# Altium schematic sheet 04 - Camera Interface.SchDoc: Camera Interface (DPHYs)
size A3; Page Number: 4; Page Size: B; Page Count: 12; Board Rev: B; Project Name: CrossLink-NX Evaluation Board; RevCode: 1.0; Doc: 305-PD-19-0819; DsnPath: C:\Users\HAltinkilit\Downloads\Crosslink-NX-Design-Files\CrossLink-NX-Eval-Brd-Schematic-RevB-191122.DSN; SchematicName: SCHEMATIC1; PageName: 04 - Camera Interface; PageSize: B; TopSchematic: True
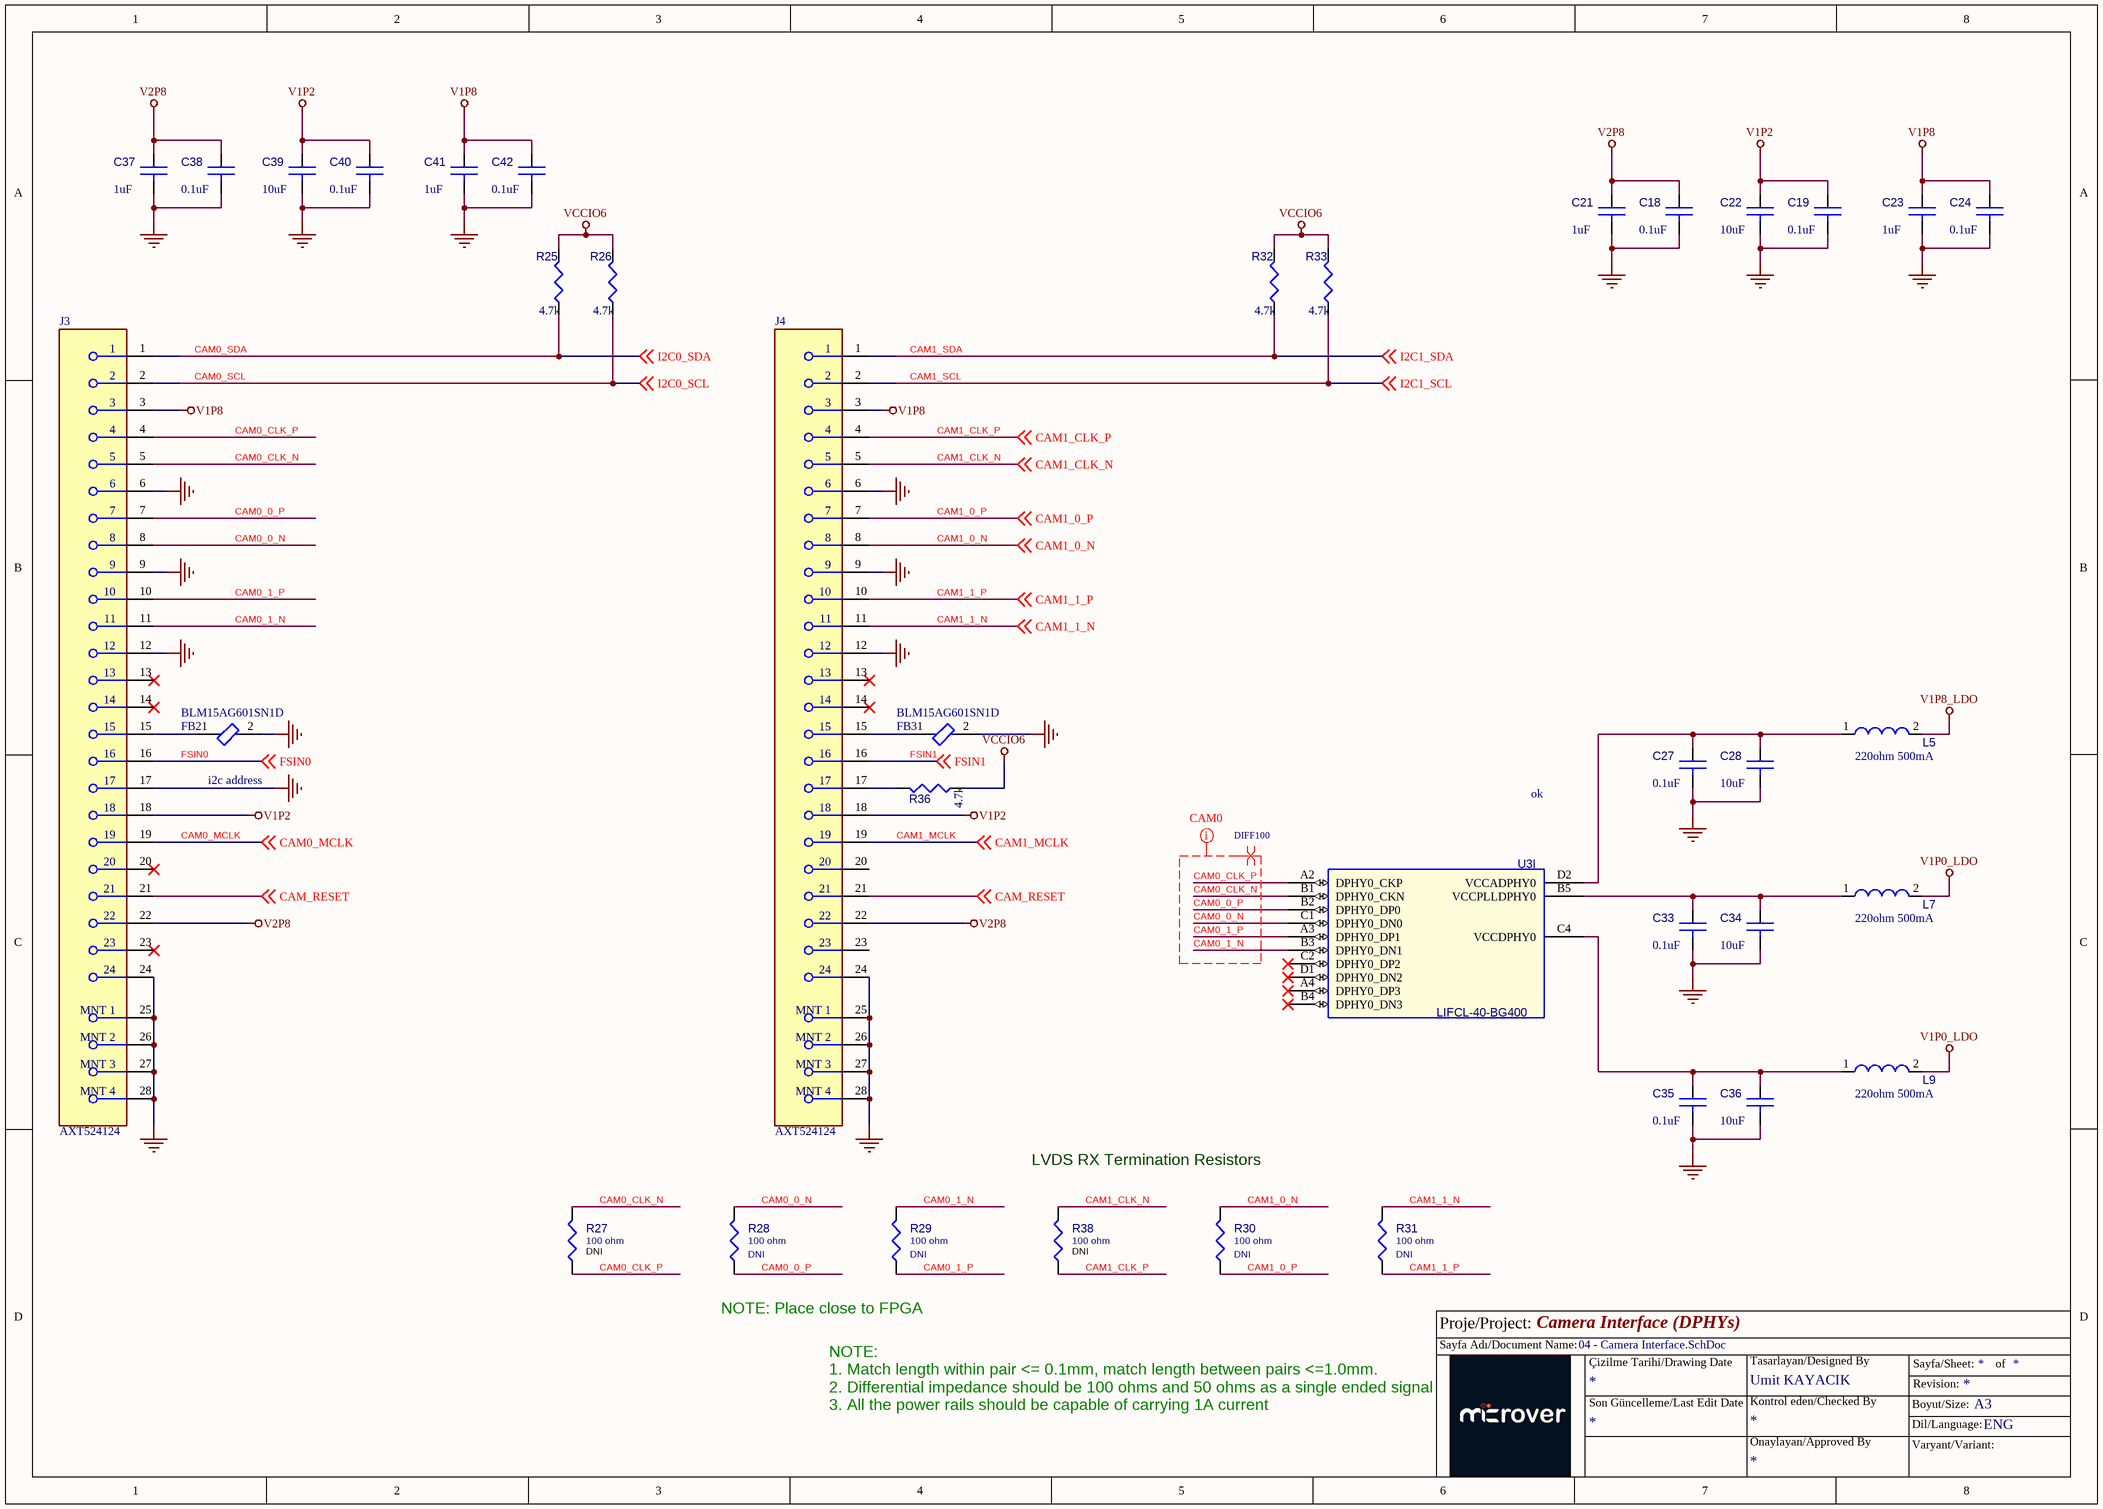
[diagram p0: 04 - Camera Interface.SchDoc]

## Parts
C18  0.1uF  [C0201]
C19  0.1uF  [C0201]
C21  1uF  [C0603]
C22  10uF  [C0603]
C23  1uF  [C0603]
C24  0.1uF  [C0201]
C27  0.1uF  [C0201]
C28  10uF  [C0402]
C33  0.1uF  [C0201]
C34  10uF  [C0402]
C35  0.1uF  [C0201]
C36  10uF  [C0402]
C37  1uF  [C0603]
C38  0.1uF  [C0201]
C39  10uF  [C0603]
C40  0.1uF  [C0201]
C41  1uF  [C0603]
C42  0.1uF  [C0201]
FB2  BLM15AG601SN1D  [FP-BLM15-0_05-MFG]
FB3  BLM15AG601SN1D  [FP-BLM15-0_05-MFG]
J3  AXT524124  [FP-AXT524124-MFG]
J4  AXT524124  [FP-AXT524124-MFG]
L5  220ohm 500mA  [FB0402]
L7  220ohm 500mA  [FB0402]
L9  220ohm 500mA  [FB0402]
R25  4.7k  [R0402]
R26  4.7k  [R0402]
R27  100 ohm  [R0201]
R28  100 ohm  Assy: DNI  [R0201]
R29  100 ohm  Assy: DNI  [R0201]
R30  100 ohm  Assy: DNI  [R0201]
R31  100 ohm  Assy: DNI  [R0201]
R32  4.7k  [R0402]
R33  4.7k  [R0402]
R36  4.7k  [R0402]
R38  100 ohm  [R0201]
U3  LIFCL-40-BG400  [LIFCL-40-BG400]  (part I of 15)

## Nets
GND: C18.2 C19.2 C21.2 C22.2 C23.2 C24.2 C27.2 C28.2 C33.2 C34.2 C35.2 C36.2 C37.2 C38.2 C39.2 C40.2 C41.2 C42.2 FB2.2 FB3.2 J3.6 J3.9 J3.12 J3.17 J3.24 J3.25(MNT_1) J3.26(MNT_2) J3.27(MNT_3) J3.28(MNT_4) J4.6 J4.9 J4.12 J4.24 J4.25(MNT_1) J4.26(MNT_2) J4.27(MNT_3) J4.28(MNT_4)
V1P0_LDO: L7.2 L9.2
V1P2: C19.1 C22.1 C39.1 C40.1 J3.18 J4.18
V1P8: C23.1 C24.1 C41.1 C42.1 J3.3 J4.3
V1P8_LDO: L5.2
V2P8: C18.1 C21.1 C37.1 C38.1 J3.22 J4.22
VCCIO6: R25.1 R26.1 R32.1 R33.1 R36.2
CAM0_0_N: J3.8 R28.2 U3.C1(DPHY0_DN0)
CAM0_0_P: J3.7 R28.1 U3.B2(DPHY0_DP0)
CAM0_1_N: J3.11 R29.2 U3.B3(DPHY0_DN1)
CAM0_1_P: J3.10 R29.1 U3.A3(DPHY0_DP1)
CAM0_CLK_N: J3.5 R27.2 U3.B1(DPHY0_CKN)
CAM0_CLK_P: J3.4 R27.1 U3.A2(DPHY0_CKP)
CAM0_MCLK: J3.19 ; off-sheet CAM0_MCLK
CAM0_SCL: J3.2 R26.2 ; off-sheet I2C0_SCL  [also labelled I2C0_SCL]
CAM0_SDA: J3.1 R25.2 ; off-sheet I2C0_SDA  [also labelled I2C0_SDA]
CAM1_0_N: J4.8 R30.2 ; off-sheet CAM1_0_N
CAM1_0_P: J4.7 R30.1 ; off-sheet CAM1_0_P
CAM1_1_N: J4.11 R31.2 ; off-sheet CAM1_1_N
CAM1_1_P: J4.10 R31.1 ; off-sheet CAM1_1_P
CAM1_CLK_N: J4.5 R38.2 ; off-sheet CAM1_CLK_N
CAM1_CLK_P: J4.4 R38.1 ; off-sheet CAM1_CLK_P
CAM1_MCLK: J4.19 ; off-sheet CAM1_MCLK
CAM1_SCL: J4.2 R33.2 ; off-sheet I2C1_SCL  [also labelled I2C1_SCL]
CAM1_SDA: J4.1 R32.2 ; off-sheet I2C1_SDA  [also labelled I2C1_SDA]
CAM_RESET: J3.21 J4.21 ; off-sheet CAM_RESET
FSIN0: J3.16 ; off-sheet FSIN0
FSIN1: J4.16 ; off-sheet FSIN1
NetC27_1: C27.1 C28.1 L5.1 U3.D2(VCCADPHY0)
NetC33_1: C33.1 C34.1 L7.1 U3.B5(VCCPLLDPHY0)
NetC35_1: C35.1 C36.1 L9.1 U3.C4(VCCDPHY0)
NetFB2_1: FB2.1 J3.15
NetFB3_1: FB3.1 J4.15
NetJ4_17: J4.17 R36.1

Not connected (* = marked no-connect by the designer): J3 13* 14* 20* 23*; J4 13* 14* 20 23; U3 A4(DPHY0_DP3)* B4(DPHY0_DN3)* C2(DPHY0_DP2)* D1(DPHY0_DN2)*

## Layout directives
net class CAM0: CAM0_0_N, CAM0_0_P, CAM0_1_N, CAM0_1_P, CAM0_CLK_N, CAM0_CLK_P
differential pair; differential pair class DIFF100: CAM0_0_N, CAM0_0_P, CAM0_1_N, CAM0_1_P, CAM0_CLK_N, CAM0_CLK_P

## Notes on the sheet
- (near FB2) i2c address
- ok
- LVDS RX Termination Resistors
- (near R27) DNI
- (near R38) DNI
- NOTE: Place close to FPGA
- NOTE:
  1. Match length within pair <= 0.1mm, match length between pairs <=1.0mm.
  2. Differential impedance should be 100 ohms and 50 ohms as a single ended signal
  3. All the power rails should be capable of carrying 1A current
- Proje/Project:
- Sayfa Adı/Document Name:
- Çizilme Tarihi/Drawing Date
- Umit KAYACIK
- Tasarlayan/Designed By
- Sayfa/Sheet:
- Revision:
- of
- Son Güncelleme/Last Edit Date
- Kontrol eden/Checked By
- Onaylayan/Approved By
- Boyut/Size:
- Varyant/Variant:
- Dil/Language:
- A3
- ENG

## Library data of the parts
C18 C38 = 0u1_0402: CAP CER 0.1UF 25V 10% X5R 0201; Manufacturer: Murata; Manufacturer Part Number: GRM033R61E104KE14J; Part Reference: C18; Class: Discrete; Digikey P/N: 399-3521-2-ND; Assy: -; Value: 0.1uF; PCB Footprint: C0201
C19 C40 = 0u1_0402: CAP CER 0.1UF 25V 10% X5R 0201; Manufacturer: Murata; Manufacturer Part Number: GRM033R61E104KE14J; Part Reference: C19; Class: Discrete; Digikey P/N: 399-3521-2-ND; Assy: -; Value: 0.1uF; PCB Footprint: C0201
C21 C37 = 10uF_0603: CAP CECAP CER 10UF 10V X5R 20% 0603; Manufacturer: Taiyo Yuden; Manufacturer Part Number: LMK107BJ106MALTD; Part Reference: C21; Class: Discrete; Digikey P/N: 587-2562-1-ND; Assy: -; Value: 1uF; PCB Footprint: C0603
C22 C39 = 10uF_0603: CAP CECAP CER 10UF 10V X5R 20% 0603; Manufacturer: Taiyo Yuden; Manufacturer Part Number: LMK107BJ106MALTD; Part Reference: C22; Class: Discrete; Digikey P/N: 587-2562-1-ND; Assy: -; Value: 10uF; PCB Footprint: C0603
C23 C41 = 10uF_0603: CAP CECAP CER 10UF 10V X5R 20% 0603; Manufacturer: Taiyo Yuden; Manufacturer Part Number: LMK107BJ106MALTD; Part Reference: C23; Class: Discrete; Digikey P/N: 587-2562-1-ND; Assy: -; Value: 1uF; PCB Footprint: C0603
C24 C42 = 0u1_0402: CAP CER 0.1UF 25V 10% X5R 0201; Manufacturer: Murata; Manufacturer Part Number: GRM033R61E104KE14J; Part Reference: C24; Class: Discrete; Digikey P/N: 399-3521-2-ND; Assy: -; Value: 0.1uF; PCB Footprint: C0201
C27 = 0u1_0402: CAP CER 0.1UF 25V 10% X5R 0201; Manufacturer: Murata; Manufacturer Part Number: GRM033R61E104KE14J; Part Reference: C27; Class: Discrete; Digikey P/N: 399-3521-2-ND; Assy: -; Value: 0.1uF; PCB Footprint: C0201
C28 = 10uF_0603: CAP CER 10UF 10V X5R 0402; Manufacturer: Samsung; Manufacturer Part Number: CL05A106MP8NUB8; Part Reference: C28; Class: Discrete; Digikey P/N: 587-2562-1-ND; Assy: -; Value: 10uF; PCB Footprint: C0402
C33 = 0u1_0402: CAP CER 0.1UF 25V 10% X5R 0201; Manufacturer: Murata; Manufacturer Part Number: GRM033R61E104KE14J; Part Reference: C33; Class: Discrete; Digikey P/N: 399-3521-2-ND; Assy: -; Value: 0.1uF; PCB Footprint: C0201
C34 = 10uF_0603: CAP CER 10UF 10V X5R 0402; Manufacturer: Samsung; Manufacturer Part Number: CL05A106MP8NUB8; Part Reference: C34; Class: Discrete; Digikey P/N: 587-2562-1-ND; Assy: -; Value: 10uF; PCB Footprint: C0402
C35 = 0u1_0402: CAP CER 0.1UF 25V 10% X5R 0201; Manufacturer: Murata; Manufacturer Part Number: GRM033R61E104KE14J; Part Reference: C35; Class: Discrete; Digikey P/N: 399-3521-2-ND; Assy: -; Value: 0.1uF; PCB Footprint: C0201
C36 = 10uF_0603: CAP CER 10UF 10V X5R 0402; Manufacturer: Samsung; Manufacturer Part Number: CL05A106MP8NUB8; Part Reference: C36; Class: Discrete; Digikey P/N: 587-2562-1-ND; Assy: -; Value: 10uF; PCB Footprint: C0402
FB2 FB3 = CMP-0686-00187-4: Chip Ferrite Bead, 0402, 600Ω @ 100MHz, 0.52Ω, 25%, 300mA; DC Resistance-Max: 600mR; Number of Lines: 1; DC Resistance (DCR): 520mR; Shielding: Unshielded; Impedance: 600R; Material: Steel; Frequency: 100MHz; Lead Free: Lead Free; Max DC Current: 300mA; Test Frequency: 100MHz; Depth: 0.55mm; Length: 1mm; Case Code (Imperial): 0402; Packaging: Tape and Reel; Height: 0.5mm; Max Operating Temperature: 125°C; Military Standard: Not; REACH SVHC: No SVHC; Case Code (Metric): 1005; Series: BLM15AG_SN; Core Material: Ferrite; Termination: SMD/SMT; DC Current: 300mA; Package Quantity: 10000; Width: 0.5mm; RoHS Compliant: Yes; Min Operating Temperature: -55°C; Current Rating: 300mA; Case/Package: 0402; Number of Pins: 2; Radiation Hardening: No; Tolerance: 25%; Number of Circuits: 1; Max Current Rating: 300mA
J3 J4 = AXT524124: AXT524124 24 Position 0.4 mm Pitch Dual Row Board to Board Socket Narrow Pitch Connector; NexarPartId: 7879795; Max Current Rating: 5A; Mated Stacking Heights: 1mm; Current Rating: 300mA; Voltage Rating: 60V; Max Voltage Rating (DC): 6.06kV; Number of Positions: 24; Contact Resistance: 90mΩ; Insulation Resistance: 1GΩ; Gender: Receptacle; Pitch: 400µm; Orientation: Straight; Max Operating Temperature: 85°C; Packaging: Cut Tape (CT); Depth: 3mm; Housing Material: Polymer; Ambient Temperature Range High: 85°C; Contact Plating: Gold; Mount: Surface Mount; Termination: Solder; Lead Free: Lead Free; Max Voltage Rating (AC): 60V; Length: 7.3mm; Contact Material: Gold, Nickel; Min Operating Temperature: -55°C; Height: 1.17mm; Number of Contacts: 24; Radiation Hardening: No; Connector Type: Socket; Number of Rows: 2; RoHS: Compliant
L5 = FB0603: FERRITE BEAD 600 OHM 0402 1LN; Manufacturer: Murata; Manufacturer Part Number: BLM15AX601SN1D; Part Reference: L5; Class: Discrete; Digikey P/N: 490-1014-1-ND; Value: 220ohm 500mA; Assy: -; PCB Footprint: FB0402
L7 = FB0603: FERRITE BEAD 600 OHM 0402 1LN; Manufacturer: Murata; Manufacturer Part Number: BLM15AX601SN1D; Part Reference: L7; Class: Discrete; Digikey P/N: 490-1014-1-ND; Value: 220ohm 500mA; Assy: -; PCB Footprint: FB0402
L9 = FB0603: FERRITE BEAD 600 OHM 0402 1LN; Manufacturer: Murata; Manufacturer Part Number: BLM15AX601SN1D; Part Reference: L9; Class: Discrete; Digikey P/N: 490-1014-1-ND; Value: 220ohm 500mA; Assy: -; PCB Footprint: FB0402
R25 R32 = 5k1_0402: RES SMD 2.2K OHM 1% 1/10W 0402; Manufacturer Part Number: ERJ-2RKF2201X; Manufacturer: Panasonic; Part Reference: R25; Class: Discrete; Digikey P/N: 311-5.10KLRTR-ND; Assy: -; Value: 4.7k; BOM NOTE: -; PCB Footprint: R0402
R26 R33 R36 = 5k1_0402: RES SMD 2.2K OHM 1% 1/10W 0402; Manufacturer Part Number: ERJ-2RKF2201X; Manufacturer: Panasonic; Part Reference: R26; Class: Discrete; Digikey P/N: 311-5.10KLRTR-ND; Assy: -; Value: 4.7k; BOM NOTE: -; PCB Footprint: R0402
R27 R38 = RES_100K_1W16_0402_5P: RES SMD 100 OHM 1% 1/20W 0201; Part Reference: R27; Unit Price (USD): 0.02; Total Area(sq-mm): 0.5; Wattage: 1/16W; DIST: FLAT; MAX_TEMP: RTMAX; MFG P/N: RC0201FR-07100RL; MFG: Yageo; TC1: 0; Assy: DNI; Length(mm): 1; Width(mm): 0.5; TC2: 0; Value: 100 ohm; Manufacturer: Yageo; Manufacturer Part Number: RC0201FR-07100RL; PCB Footprint: R0201
R28 = RES_100K_1W16_0402_5P: RES SMD 100 OHM 1% 1/20W 0201; Part Reference: R28; Unit Price (USD): 0.02; Total Area(sq-mm): 0.5; Wattage: 1/16W; DIST: FLAT; MAX_TEMP: RTMAX; MFG P/N: RC0201FR-07100RL; MFG: Yageo; TC1: 0; Length(mm): 1; Width(mm): 0.5; TC2: 0; Value: 100 ohm; Manufacturer: Yageo; Manufacturer Part Number: RC0201FR-07100RL; PCB Footprint: R0201
R29 = RES_100K_1W16_0402_5P: RES SMD 100 OHM 1% 1/20W 0201; Part Reference: R29; Unit Price (USD): 0.02; Total Area(sq-mm): 0.5; Wattage: 1/16W; DIST: FLAT; MAX_TEMP: RTMAX; MFG P/N: RC0201FR-07100RL; MFG: Yageo; TC1: 0; Length(mm): 1; Width(mm): 0.5; TC2: 0; Value: 100 ohm; Manufacturer: Yageo; Manufacturer Part Number: RC0201FR-07100RL; PCB Footprint: R0201
R30 = RES_100K_1W16_0402_5P: RES SMD 100 OHM 1% 1/20W 0201; Part Reference: R30; Unit Price (USD): 0.02; Total Area(sq-mm): 0.5; Wattage: 1/16W; DIST: FLAT; MAX_TEMP: RTMAX; MFG P/N: RC0201FR-07100RL; MFG: Yageo; TC1: 0; Length(mm): 1; Width(mm): 0.5; TC2: 0; Value: 100 ohm; Manufacturer Part Number: RC0201FR-07100RL; Manufacturer: Yageo; PCB Footprint: R0201
R31 = RES_100K_1W16_0402_5P: RES SMD 100 OHM 1% 1/20W 0201; Part Reference: R31; Unit Price (USD): 0.02; Total Area(sq-mm): 0.5; Wattage: 1/16W; DIST: FLAT; MAX_TEMP: RTMAX; MFG P/N: RC0201FR-07100RL; MFG: Yageo; TC1: 0; Length(mm): 1; Width(mm): 0.5; TC2: 0; Value: 100 ohm; Manufacturer Part Number: RC0201FR-07100RL; Manufacturer: Yageo; PCB Footprint: R0201
U3 = LIFCL-40-BG400: Part Reference: U3; SWAP_INFO: (S1+S2+S3+S4+S5+S6+S7+S8+S9+S10+S11+S12+S13+S14+S15); SPLIT_INST: TRUE; Graphic: LIFCL-40-BG400A.Normal; Power Pins Visible: False; Source Library: C:\USERS\SLIU1\DOCUMENTS\PCB_DESIGN\JEDI_EVAL_BOARD\SCHEMATIC\LIFCL40.OLB; Location Y-Coordinate: 0; Implementation Type: <none>; Primitive: DEFAULT; Name: I17266603; Value: LIFCL-40-BG400; Assy: -; Source Package: LIFCL-40-BG400; Source Part: LIFCL-40-BG400A.Normal; Color: Default; Location X-Coordinate: 0; PCB Footprint: LIFCL-40-BG400